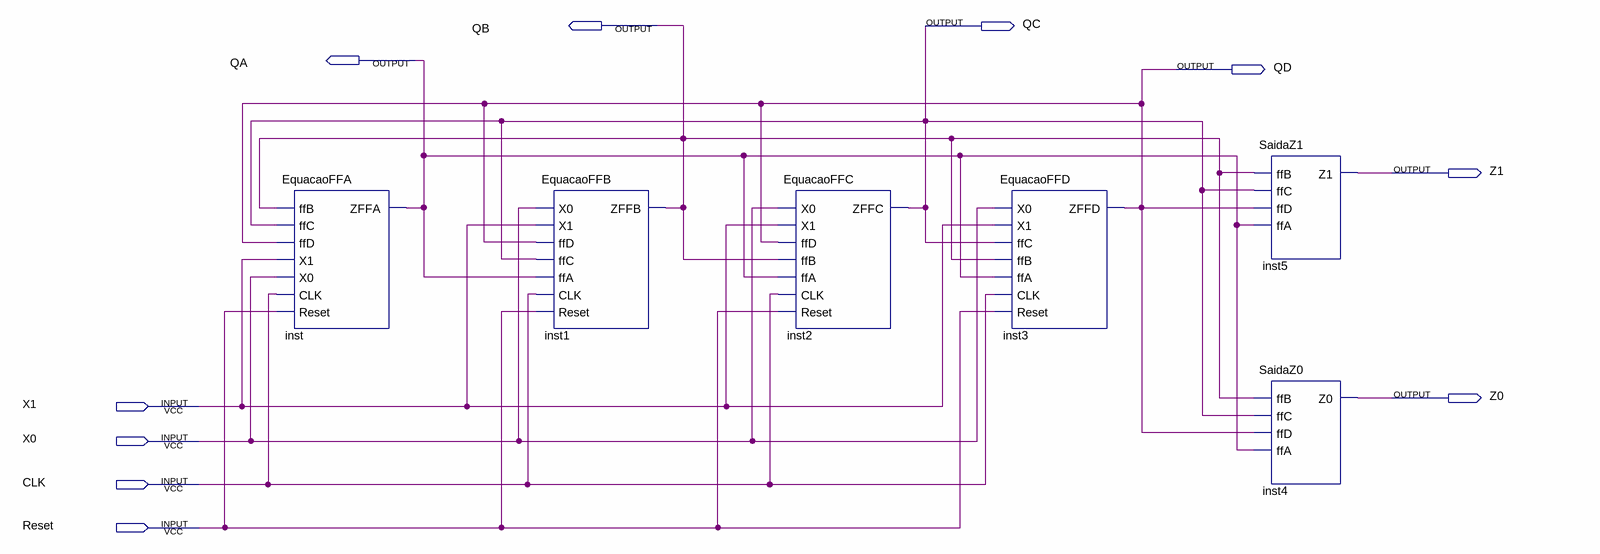
[diagram p0: schematic sheet]
// Quartus schematic MaquinaCedulas.bdf as structural Verilog: 6 symbols, 10 pins
module MaquinaCedulas (
  input  X1,
  input  X0,
  input  CLK,
  input  Reset,
  output QB,
  output QC,
  output QA,
  output QD,
  output Z1,
  output Z0
);

  EquacaoFFA inst (.ffB(QB), .ffC(QC), .ffD(QD), .X1(X1), .X0(X0), .CLK(CLK), .Reset(Reset), .ZFFA(QA));
  EquacaoFFB inst1 (.X0(X0), .X1(X1), .ffD(QD), .ffC(QC), .ffA(QA), .CLK(CLK), .Reset(Reset), .ZFFB(QB));
  EquacaoFFC inst2 (.X0(X0), .X1(X1), .ffD(QD), .ffB(QB), .ffA(QA), .CLK(CLK), .Reset(Reset), .ZFFC(QC));
  EquacaoFFD inst3 (.X0(X0), .X1(X1), .ffC(QC), .ffB(QB), .ffA(QA), .CLK(CLK), .Reset(Reset), .ZFFD(QD));
  SaidaZ1 inst5 (.ffB(QB), .ffC(QC), .ffD(QD), .ffA(QA), .Z1(Z1));
  SaidaZ0 inst4 (.ffB(QB), .ffC(QC), .ffD(QD), .ffA(QA), .Z0(Z0));
endmodule
